# Altium schematic sheet modFOC-Motion_Controller.SchDoc: modFOC-Motion_Controller
size A4; Date: dssd; Organization: HTL St. Pölten; Address1: Mathias Giller; DocumentNumber: 1; Revision: 1.0; SheetNumber: 1; SheetTotal: 3
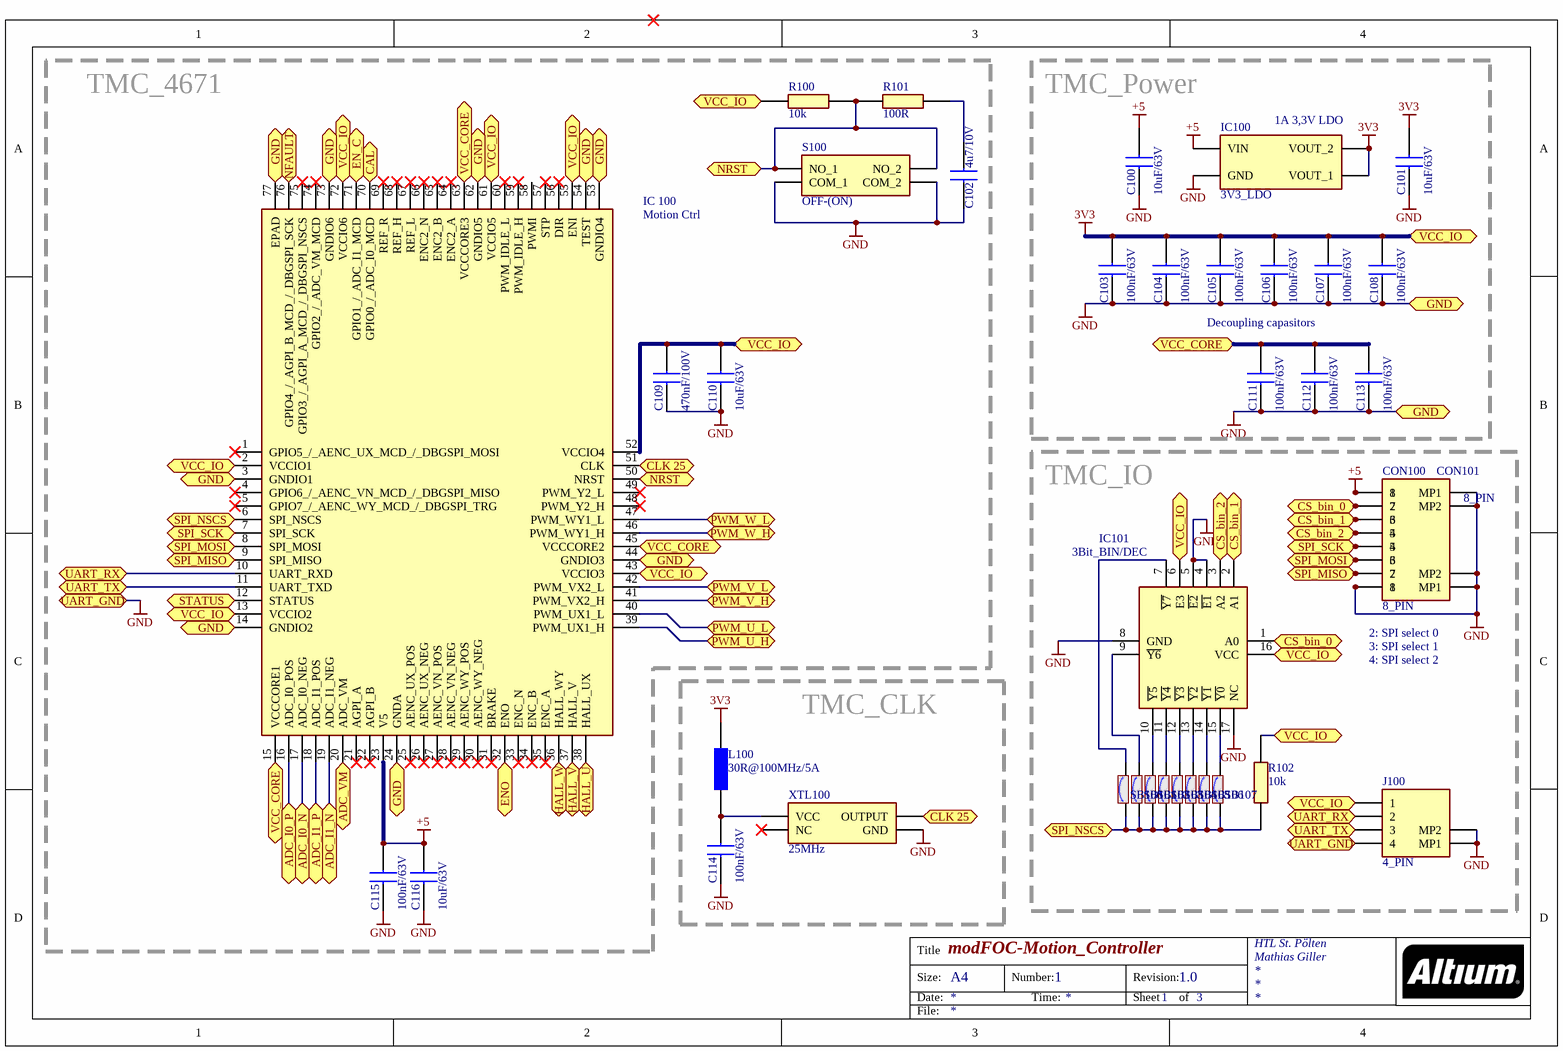
[diagram p0: modFOC-Motion_Controller.SchDoc]

## Parts
C100  10uF/63V  [CAPC3225X280N]
C101  10uF/63V  [CAPC3225X280N]
C102  4u7/10V  [CAPC1608X90N]
C103  100nF/63V  [CAPC1608X97N]
C104  100nF/63V  [CAPC1608X97N]
C105  100nF/63V  [CAPC1608X97N]
C106  100nF/63V  [CAPC1608X97N]
C107  100nF/63V  [CAPC1608X97N]
C108  100nF/63V  [CAPC1608X97N]
C109  470nF/100V  [CAPC2012X140N]
C110  10uF/63V  [CAPC3225X280N]
C111  100nF/63V  [CAPC1608X97N]
C112  100nF/63V  [CAPC1608X97N]
C113  100nF/63V  [CAPC1608X97N]
C114  100nF/63V  [CAPC1608X97N]
C115  100nF/63V  [CAPC1608X97N]
C116  10uF/63V  [CAPC3225X280N]
CON100  8_PIN  [DF13A8P125H21]
CON101  8_PIN  [DF13A8P125H21]
IC100  3V3_LDO  [SOT230P700X180-4N]
IC101  3Bit_BIN/DEC  [74HCT595BQ115]
IC_100  Motion Ctrl  [QFN40P1050X650X90-77N]
J100  4_PIN  [DF13A4P125H21]
L100  30R@100MHz/5A  [BLM18KG101TH1D]
R100  10k  [RESC1608X55N]
R101  100R  [RESC1608X55N]
R102  10k  [RESC1608X55N]
S100  OFF-(ON)  [PTS647SK38SMTR2LFS]
SB100  Solder Bridge  [SOLDER-BRIDGE_R0603-0R]  (value not drawn)
SB101  Solder Bridge  [SOLDER-BRIDGE_R0603-0R]  (value not drawn)
SB102  Solder Bridge  [SOLDER-BRIDGE_R0603-0R]  (value not drawn)
SB103  Solder Bridge  [SOLDER-BRIDGE_R0603-0R]  (value not drawn)
SB104  Solder Bridge  [SOLDER-BRIDGE_R0603-0R]  (value not drawn)
SB105  Solder Bridge  [SOLDER-BRIDGE_R0603-0R]  (value not drawn)
SB106  Solder Bridge  [SOLDER-BRIDGE_R0603-0R]  (value not drawn)
SB107  Solder Bridge  [SOLDER-BRIDGE_R0603-0R]  (value not drawn)
XTL100  25MHz  [FOX924B25]

## Blocks framed on the sheet
TMC_4671: C102 C109 C110 C115 C116 IC_100 R100 R101 S100
TMC_Power: C100 C101 C103-C108 C111-C113 IC100
TMC_IO: CON100 CON101 IC101 J100 R102 SB100-SB107
TMC_CLK: C114 L100 XTL100

## Ports
ADC_I0_N (bidir), ADC_I0_P (bidir), ADC_I1_N (bidir), ADC_I1_P (bidir), ADC_VM (bidir), CAL (bidir), CLK 25 (bidir), CS_bin_0 (bidir), CS_bin_1 (bidir), CS_bin_2 (bidir), EN_C (bidir), ENO (bidir), GND (bidir), HALL_U (bidir), HALL_V (bidir), HALL_W (bidir), NFAULT (bidir), NRST (bidir), PWM_U_H (bidir), PWM_U_L (bidir), PWM_V_H (bidir), PWM_V_L (bidir), PWM_W_H (bidir), PWM_W_L (bidir), SPI_MISO (bidir), SPI_MOSI (bidir), SPI_NSCS (bidir), SPI_SCK (bidir), STATUS (bidir), UART_GND (bidir), UART_RX (bidir), UART_TX (bidir), VCC_CORE (bidir), VCC_IO (bidir)

## Nets
3V3: C101.1 C103.2 C104.2 C105.2 C106.2 C107.2 C108.2 C109.2 C110.1 IC100.2(VOUT_1) IC100.4(VOUT_2) IC101.6(E3) IC101.16(VCC) IC_100.2(VCCIO1) IC_100.13(VCCIO2) IC_100.43(VCCIO3) IC_100.52(VCCIO4) IC_100.55(ENI) IC_100.61(VCCIO5) IC_100.72(VCCIO6) J100.1 L100.1 R100.1 R102.2 ; port VCC_IO
+5: C100.1 C115.2 C116.1 CON100.1 CON101.8 IC100.3(VIN) IC_100.23(V5)
GND: C100.2 C101.2 C102.1 C103.1 C104.1 C105.1 C106.1 C107.1 C108.1 C109.1 C110.2 C111.1 C112.1 C113.1 C114.1 C115.1 C116.2 CON100.8 CON100.MP1 CON100.MP2 CON101.1 CON101.MP1 CON101.MP2 IC100.1(GND) IC101.4(~{E1}) IC101.5(~{E2}) IC101.8(GND) IC101.17(NC) IC_100.3(GNDIO1) IC_100.14(GNDIO2) IC_100.24(GNDA) IC_100.44(GNDIO3) IC_100.53(GNDIO4) IC_100.54(TEST) IC_100.62(GNDIO5) IC_100.73(GNDIO6) IC_100.77(EPAD) J100.4 J100.MP1 J100.MP2 S100.3(COM_1) S100.4(COM_2) XTL100.2(GND) ; port GND, port UART_GND
ADC_I0_N: IC_100.17(ADC_I0_NEG) ; port ADC_I0_N
ADC_I0_P: IC_100.16(ADC_I0_POS) ; port ADC_I0_P
ADC_I1_N: IC_100.19(ADC_I1_NEG) ; port ADC_I1_N
ADC_I1_P: IC_100.18(ADC_I1_POS) ; port ADC_I1_P
ADC_VM: IC_100.20(ADC_VM) ; port ADC_VM
CAL: IC_100.70(GPIO0_/_ADC_I0_MCD) ; port CAL
CLK 25: IC_100.51(CLK) XTL100.3(OUTPUT) ; port CLK 25
CS_bin_0: CON100.2 CON101.7 IC101.1(A0) ; port CS_bin_0
CS_bin_1: CON100.3 CON101.6 IC101.2(A1) ; port CS_bin_1
CS_bin_2: CON100.4 CON101.5 IC101.3(A2) ; port CS_bin_2
EN_C: IC_100.71(GPIO1_/_ADC_I1_MCD) ; port EN_C
ENO: IC_100.32(ENO) ; port ENO
HALL_U: IC_100.38(HALL_UX) ; port HALL_U
HALL_V: IC_100.37(HALL_V) ; port HALL_V
HALL_W: IC_100.36(HALL_WY) ; port HALL_W
NFAULT: IC_100.76(GPIO4_/_AGPI_B_MCD_/_DBGSPI_SCK) ; port NFAULT
NRST: IC_100.50(NRST) R100.2 R101.1 S100.1(NO_1) S100.2(NO_2) ; port NRST
PWM_U_H: IC_100.39(PWM_UX1_H) ; port PWM_U_H
PWM_U_L: IC_100.40(PWM_UX1_L) ; port PWM_U_L
PWM_V_H: IC_100.41(PWM_VX2_H) ; port PWM_V_H
PWM_V_L: IC_100.42(PWM_VX2_L) ; port PWM_V_L
PWM_W_H: IC_100.46(PWM_WY1_H) ; port PWM_W_H
PWM_W_L: IC_100.47(PWM_WY1_L) ; port PWM_W_L
SPI_MISO: CON100.7 CON101.2 IC_100.9(SPI_MISO) ; port SPI_MISO
SPI_MOSI: CON100.6 CON101.3 IC_100.8(SPI_MOSI) ; port SPI_MOSI
SPI_NSCS: IC_100.6(SPI_NSCS) R102.1 SB100.1 SB101.1 SB102.1 SB103.1 SB104.1 SB105.1 SB106.1 SB107.1 ; port SPI_NSCS
SPI_SCK: CON100.5 CON101.4 IC_100.7(SPI_SCK) ; port SPI_SCK
STATUS: IC_100.12(STATUS) ; port STATUS
UART_RX: IC_100.10(UART_RXD) J100.2 ; port UART_RX
UART_TX: IC_100.11(UART_TXD) J100.3 ; port UART_TX
VCC_CORE: C111.2 C112.2 C113.2 IC_100.15(VCCCORE1) IC_100.45(VCCCORE2) IC_100.63(VCCCORE3) ; port VCC_CORE
NetC102_2: C102.2 R101.2
NetC114_2: C114.2 L100.2 XTL100.4(VCC)
NetIC101_7: IC101.7(~{Y7}) SB100.2
NetIC101_9: IC101.9(~{Y6}) SB101.2
NetIC101_10: IC101.10(~{Y5}) SB102.2
NetIC101_11: IC101.11(~{Y4}) SB103.2
NetIC101_12: IC101.12(~{Y3}) SB104.2
NetIC101_13: IC101.13(~{Y2}) SB105.2
NetIC101_14: IC101.14(~{Y1}) SB106.2
NetIC101_15: IC101.15(~{Y0}) SB107.2

Not connected (* = marked no-connect by the designer): IC_100 1(GPIO5_/_AENC_UX_MCD_/_DBGSPI_MOSI)* 4(GPIO6_/_AENC_VN_MCD_/_DBGSPI_MISO)* 5(GPIO7_/_AENC_WY_MCD_/_DBGSPI_TRG)* 21(AGPI_A)* 22(AGPI_B)* 25(AENC_UX_POS)* 26(AENC_UX_NEG)* 27(AENC_VN_POS)* 28(AENC_VN_NEG)* 29(AENC_WY_POS)* 30(AENC_WY_NEG)* 31(BRAKE)* 33(ENC_N)* 34(ENC_B)* 35(ENC_A)* 48(PWM_Y2_H)* 49(PWM_Y2_L)* 56(DIR)* 57(STP)* 58(PWMI) 59(PWM_IDLE_H)* 60(PWM_IDLE_L)* 64(ENC2_A)* 65(ENC2_B)* 66(ENC2_N)* 67(REF_L)* 68(REF_H)* 69(REF_R)* 74(GPIO2_/_ADC_VM_MCD)* 75(GPIO3_/_AGPI_A_MCD_/_DBGSPI_NSCS)*; XTL100 1(NC)*

## Notes on the sheet
- (near IC100) 1A 3,3V LDO
- Decoupling capasitors
- 2: SPI select 0
- 3: SPI select 1
- 4: SPI select 2
- Title
- Size:
- Date:
- A4
- Number:
- Time:
- Revision:
- Sheet
- of
- File:

## Library data of the parts
C100 C101 C110 C116 = CL32B106KMVNNWE: Capacitor; Manufacturer_Name: Samsung Electro-Mechanics; Datasheet Link: https://www.arrow.com/en/products/cl32b106kmvnnwe/samsung-electro-mechanics; Height: 2.8mm; Manufacturer_Part_Number: CL32B106KMVNNWE; Arrow Part Number: CL32B106KMVNNWE; Arrow Price/Stock: https://www.arrow.com/en/products/cl32b106kmvnnwe/samsung-electro-mechanics; Mouser Part Number: 187-CL32B106KMVNNWE; Mouser Price/Stock: https://www.mouser.co.uk/ProductDetail/Samsung-Electro-Mechanics/CL32B106KMVNNWE?qs=xZ%2FP%252Ba9zWqaEMBbSgKy8gQ%3D%3D
C102 = CL10A475KP8NNNC: Capacitor; Manufacturer_Name: Samsung Electro-Mechanics; Datasheet Link: https://www.arrow.com/en/products/cl10a475kp8nnnc/samsung-electro-mechanics; Height: 0.9mm; Manufacturer_Part_Number: CL10A475KP8NNNC; Mouser Part Number: 187-CL10A475KP8NNNC; Mouser Price/Stock: https://www.mouser.co.uk/ProductDetail/Samsung-Electro-Mechanics/CL10A475KP8NNNC/?qs=hqM3L16%252BxlfQRmkWsZz5vA%3D%3D; Arrow Part Number: CL10A475KP8NNNC; Arrow Price/Stock: https://www.arrow.com/en/products/cl10a475kp8nnnc/samsung-electro-mechanics
C103-C108 C111-C115 = C0805C104MMREC7210: Capacitor; Manufacturer_Name: Vishay; Manufacturer_Part_Number: VJ0603Y104JXJAC; Datasheet Link: http://www.vishay.com/docs/45226/vj31xrohsautomlcc.pdf; Height: 1mm; Mouser Part Number: 77-VJ0603Y104JXJAC; Mouser Price/Stock: https://www.mouser.com/Search/Refine.aspx?Keyword=77-VJ0603Y104JXJAC
C109 = 08051C474KAT2A: Capacitor; Manufacturer_Name: AVX; Datasheet Link: http://datasheets.avx.com/X7RDielectric.pdf; Height: 1.4mm; Manufacturer_Part_Number: 08051C474KAT2A; Mouser Part Number: 581-08051C474KAT2A; Mouser Price/Stock: https://www.mouser.co.uk/ProductDetail/AVX/08051C474KAT2A?qs=%2FjdEcI0p95Mz%2FN5KbrGN6Q%3D%3D
CON100 CON101 = DF13A-8P-1.25H_21_: Connector; Manufacturer_Name: Hirose; Manufacturer_Part_Number: DF13A-8P-1.25H(21); Datasheet Link: http://uk.rs-online.com/web/p/products/7793617P; Height: 3.6mm; Mouser Part Number: 798-DF13A8P125H21; Mouser Price/Stock: https://www.mouser.co.uk/ProductDetail/Hirose-Connector/DF13A-8P-125H21?qs=XQjbzJWzFPViW0MGk5%2FVbA%3D%3D
IC100 = AP2114H-3.3TRG1: Integrated Circuit; Manufacturer_Name: Diodes Inc.; Datasheet Link: http://uk.rs-online.com/web/p/products/8283528; Height: 1.8mm; Manufacturer_Part_Number: AP2114H-3.3TRG1; Arrow Part Number: AP2114H-3.3TRG1; Arrow Price/Stock: https://www.arrow.com/en/products/ap2114h-3.3trg1/diodes-incorporated; Mouser Part Number: 621-AP2114H-3.3TRG1; Mouser Price/Stock: https://www.mouser.co.uk/ProductDetail/Diodes-Incorporated/AP2114H-33TRG1?qs=x6A8l6qLYDDSG%2FfwzcsOhw%3D%3D
IC101 = 74LVC138ABQ,115: Integrated Circuit; Manufacturer_Name: Nexperia; Datasheet Link: https://assets.nexperia.com/documents/data-sheet/74LVC138A.pdf; Manufacturer_Part_Number: 74LVC138ABQ,115; Arrow Part Number: 74LVC138ABQ,115; Arrow Price/Stock: https://www.arrow.com/en/products/74lvc138abq115/nexperia; Mouser Part Number: 771-LVC138ABQ115; Mouser Price/Stock: https://www.mouser.co.uk/ProductDetail/Nexperia/74LVC138ABQ115?qs=me8TqzrmIYUqHGpwzmLq4w%3D%3D
IC_100 = TMC4671-LA IC: FOC Motion Controller; Manufacturer_Name: Trinamic; Manufacturer_Part_Number: TMC4671-LA
J100 = DF13A-4P-1.25H_21_: Connector; Manufacturer_Name: Hirose; Manufacturer_Part_Number: DF13A-4P-1.25H(21); Datasheet Link: https://componentsearchengine.com/Datasheets/1/DF13A-4P-1.25H(21).pdf; Height: 3.6mm; Mouser Part Number: 798-DF13A4P125H21; Mouser Price/Stock: https://www.mouser.co.uk/ProductDetail/Hirose-Connector/DF13A-4P-125H21/?qs=XQjbzJWzFPXWzMShI70F0w%3D%3D
L100 = BLM18KG300TH1D: Ferrite Bead; Manufacturer_Name: Murata Electronics; Datasheet Link: https://www.murata.com/en-us/products/productdetail?partno=BLM18KG300TH1%23; Height: 0.75mm; Manufacturer_Part_Number: BLM18KG300TH1D; Arrow Part Number: BLM18KG300TH1D; Arrow Price/Stock: https://www.arrow.com/en/products/blm18kg300th1d/murata-manufacturing; Mouser Part Number: 81-BLM18KG300TH1D; Mouser Price/Stock: https://www.mouser.com/Search/Refine.aspx?Keyword=81-BLM18KG300TH1D
R100 R102 = RC0603FR-0710KL: Resistor; Manufacturer_Name: YAGEO (PHYCOMP); Datasheet Link: http://www.yageo.com/documents/recent/PYu-RC0603_51_RoHS_L_v5.pdf; Height: 0.55mm; Manufacturer_Part_Number: RC0603FR-0710KL; Arrow Part Number: RC0603FR-0710KL; Arrow Price/Stock: https://www.arrow.com/en/products/rc0603fr-0710kl/yageo; Mouser Part Number: 603-RC0603FR-0710KL; Mouser Price/Stock: https://www.mouser.co.uk/ProductDetail/Yageo/RC0603FR-0710KL?qs=grNVn54RoB%252B3GtjbJj3wJQ%3D%3D
R101 = CRCW0603100RFKEAC: Resistor; Manufacturer_Name: Vishay; Datasheet Link: https://componentsearchengine.com/Datasheets/1/CRCW0603100RFKEAC.pdf; Height: 0.55mm; Manufacturer_Part_Number: CRCW0603100RFKEAC; Mouser Part Number: 71-CRCW0603100RFKEAC; Mouser Price/Stock: https://www.mouser.co.uk/ProductDetail/Vishay-Dale/CRCW0603100RFKEAC/?qs=E3Y5ESvWgWPJqb4%2F19sAKw%3D%3D; Arrow Part Number: CRCW0603100RFKEAC; Arrow Price/Stock: https://www.arrow.com/en/products/crcw0603100rfkeac/vishay
S100 = PTS647SK38SMTR2LFS: Switch; Manufacturer_Name: C & K COMPONENTS; Datasheet Link: https://www.ckswitches.com/media/2567/pts647.pdf; Height: 3.8mm; Manufacturer_Part_Number: PTS647SK38SMTR2LFS; Mouser Part Number: 611-PTS647SK38SMTR2L; Mouser Price/Stock: https://www.mouser.co.uk/ProductDetail/CK/PTS647SK38SMTR2LFS/?qs=PqoDHHvF649Jgx1Ch2uMjg%3D%3D
SB100-SB107 = Solder Bridge: Internal_Part_Number: MCD-00071; Part_Type: Mechanical; Manufacturer_Part_Number: RC0603JR-070RL; Manufacturer: YAGEO; Provided_By: SUBCO; ECCN_US: n/a; ECCN_EU: n/a; Status: Released; Package: SB0603; ComponentLink1Description: Datasheet; ComponentLink1URL: http://tunmcdsvn.tun.st.com/Component_Datasheet_Library/Trunk/Resistors/Yageo_Resistor_RC0603-series
XTL100 = FOX924B-25: 25Mhz Oscillator; Manufacturer_Name: FOX; Manufacturer_Part_Number: FOX924B-25